# Altium schematic sheet FUNCTION_EFUSE.SchDoc
size 420 x 297 mm; SheetNumber: 17; SheetTotal: 20
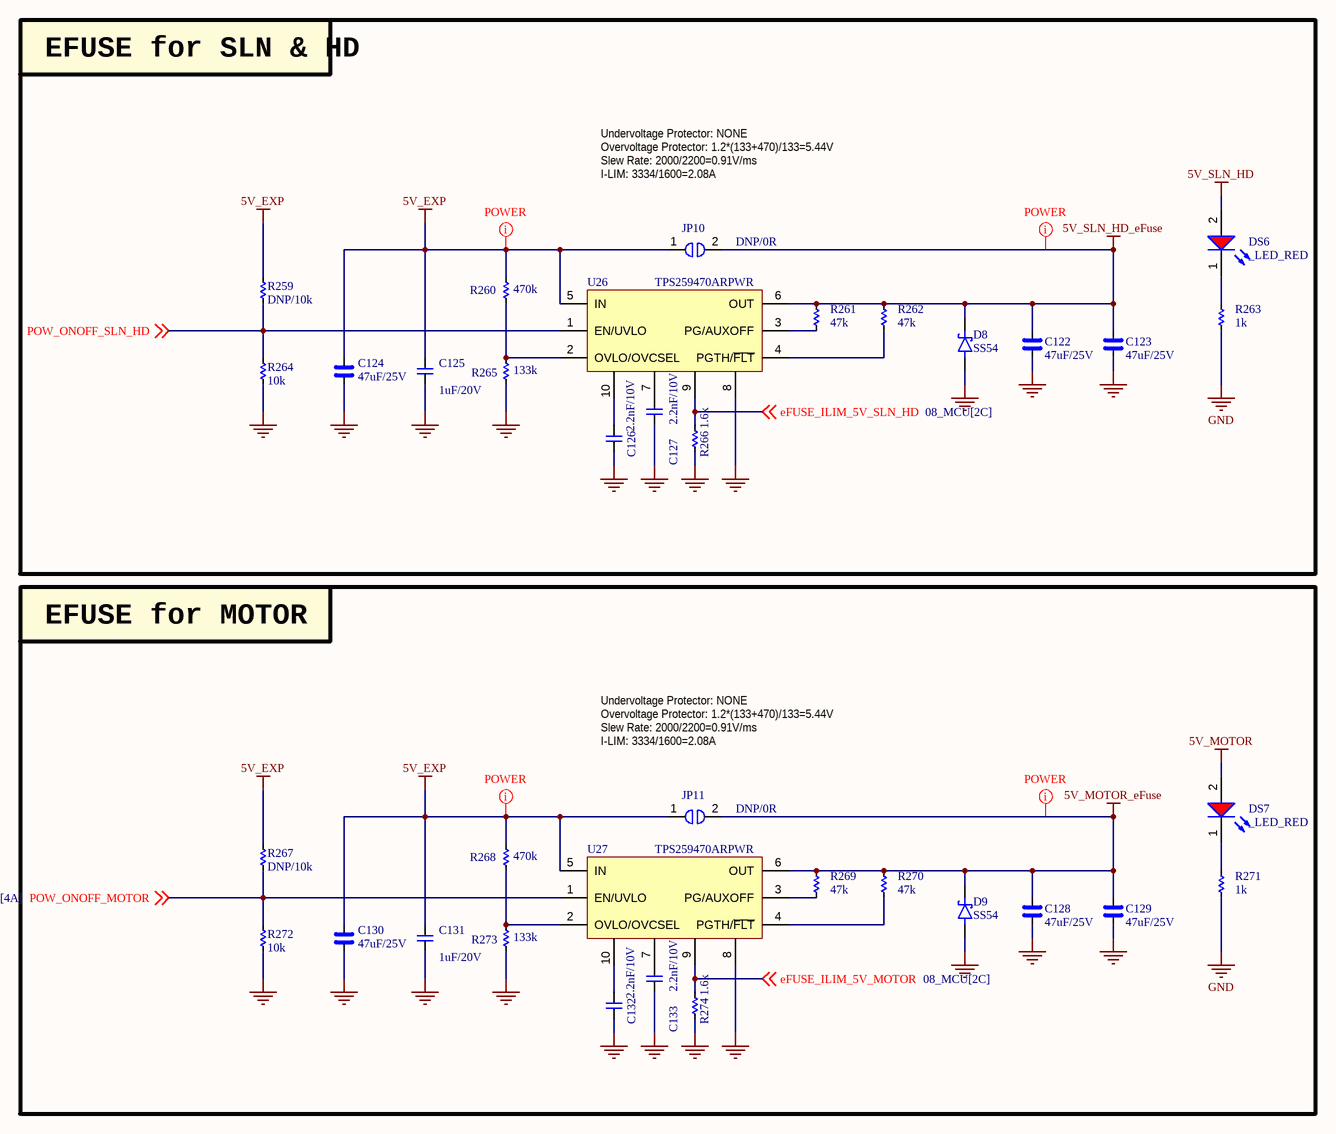
[diagram p0: FUNCTION_EFUSE.SchDoc]

## Parts
C122  47uF/25V  [CAP_C_3225X80]
C123  47uF/25V  [CAP_C_3225X80]
C124  47uF/25V  [CAP_C_3225X80]
C125  1uF/20V  [CAP_C_1005X50_L]
C126  2.2nF/10V  [CAP_C_1005X50_L]
C127  2.2nF/10V  [CAP_C_1005X50_L]
C128  47uF/25V  [CAP_C_3225X80]
C129  47uF/25V  [CAP_C_3225X80]
C130  47uF/25V  [CAP_C_3225X80]
C131  1uF/20V  [CAP_C_1005X50_L]
C132  2.2nF/10V  [CAP_C_1005X50_L]
C133  2.2nF/10V  [CAP_C_1005X50_L]
D8  SS54  [DO-214AC_SMA]
D9  SS54  [DO-214AC_SMA]
DS6  _LED_RED  [LED_0603]
DS7  _LED_RED  [LED_0603]
JP10  DNP/0R  [JUMPER_1608]
JP11  DNP/0R  [JUMPER_1608]
R259  DNP/10k  [RES_C_1005X40]
R260  470k  [RES_C_1005X40]
R261  47k  [RES_C_1005X40]
R262  47k  [RES_C_1005X40]
R263  1k  [RES_C_1005X40]
R264  10k  [RES_C_1005X40]
R265  133k  [RES_C_1005X40]
R266  1.6k  [RES_C_1005X40]
R267  DNP/10k  [RES_C_1005X40]
R268  470k  [RES_C_1005X40]
R269  47k  [RES_C_1005X40]
R270  47k  [RES_C_1005X40]
R271  1k  [RES_C_1005X40]
R272  10k  [RES_C_1005X40]
R273  133k  [RES_C_1005X40]
R274  1.6k  [RES_C_1005X40]
U26  TPS259470ARPWR  [VQFN-HR-10]
U27  TPS259470ARPWR  [VQFN-HR-10]

## Blocks framed on the sheet
EFUSE for SLN & HD: C122-C127 D8 DS6 JP10 R259-R266 U26
EFUSE for MOTOR: C128-C133 D9 DS7 JP11 R267-R274 U27

## Nets
5V_EXP: C124.2 C125.2 C130.2 C131.2 JP10.1 JP11.1 R259.1 R260.2 R267.1 R268.2 U26.5(IN) U27.5(IN)
5V_MOTOR: DS7.2(A)
5V_MOTOR_eFuse: C128.2 C129.2 D9.1(K) JP11.2 R269.2 R270.2 U27.6(OUT)
5V_SLN_HD: DS6.2(A)
5V_SLN_HD_eFuse: C122.2 C123.2 D8.1(K) JP10.2 R261.2 R262.2 U26.6(OUT)
GND: C122.1 C123.1 C124.1 C125.1 C126.1 C127.1 C128.1 C129.1 C130.1 C131.1 C132.1 C133.1 D8.2(A) D9.2(A) R263.1 R264.2 R265.1 R266.1 R271.1 R272.2 R273.1 R274.1 U26.8 U27.8
eFUSE_ILIM_5V_MOTOR: R274.2 U27.9 ; off-sheet eFUSE_ILIM_5V_MOTOR
eFUSE_ILIM_5V_SLN_HD: R266.2 U26.9 ; off-sheet eFUSE_ILIM_5V_SLN_HD
POW_ONOFF_MOTOR: R267.2 R272.1 U27.1(EN/UVLO) ; off-sheet POW_ONOFF_MOTOR
POW_ONOFF_SLN_HD: R259.2 R264.1 U26.1(EN/UVLO) ; off-sheet POW_ONOFF_SLN_HD
NetC126_2: C126.2 U26.10
NetC127_2: C127.2 U26.7
NetC132_2: C132.2 U27.10
NetC133_2: C133.2 U27.7
NetDS6_1: DS6.1(K) R263.2
NetDS7_1: DS7.1(K) R271.2
NetR260_1: R260.1 R265.2 U26.2(OVLO/OVCSEL)
NetR261_1: R261.1 U26.3(PG/AUXOFF)
NetR262_1: R262.1 U26.4(PGTH/~{FLT})
NetR268_1: R268.1 R273.2 U27.2(OVLO/OVCSEL)
NetR269_1: R269.1 U27.3(PG/AUXOFF)
NetR270_1: R270.1 U27.4(PGTH/~{FLT})

## Layout directives
net class POWER: 5V_EXP, 5V_MOTOR_eFuse, 5V_SLN_HD_eFuse

## Notes on the sheet
- Undervoltage Protector: NONE
- Overvoltage Protector: 1.2*(133+470)/133=5.44V
- Slew Rate: 2000/2200=0.91V/ms
- I-LIM: 3334/1600=2.08A
- Project
- Sub-system:
- Design by:
- Sheet title:
- Sheet:
- of
- Checked by:
- Approved by:
- Doc no:
- Revision
- Size:
- Date:

## Library data of the parts
C122-C124 C128-C130 = _CAP_C_High_2: CAP High Value
C125-C127 C131-C133 = _CAP_C_2: CAP
D8 D9 = DIODE SCHOTTKY
JP10 JP11 = JUMPER_1_1
R259-R274 = _RES_B_2: RES